# EAGLE schematic Dyno Tiva Shield (EAGLE 7.5.0)

## Sheet 1 of 2
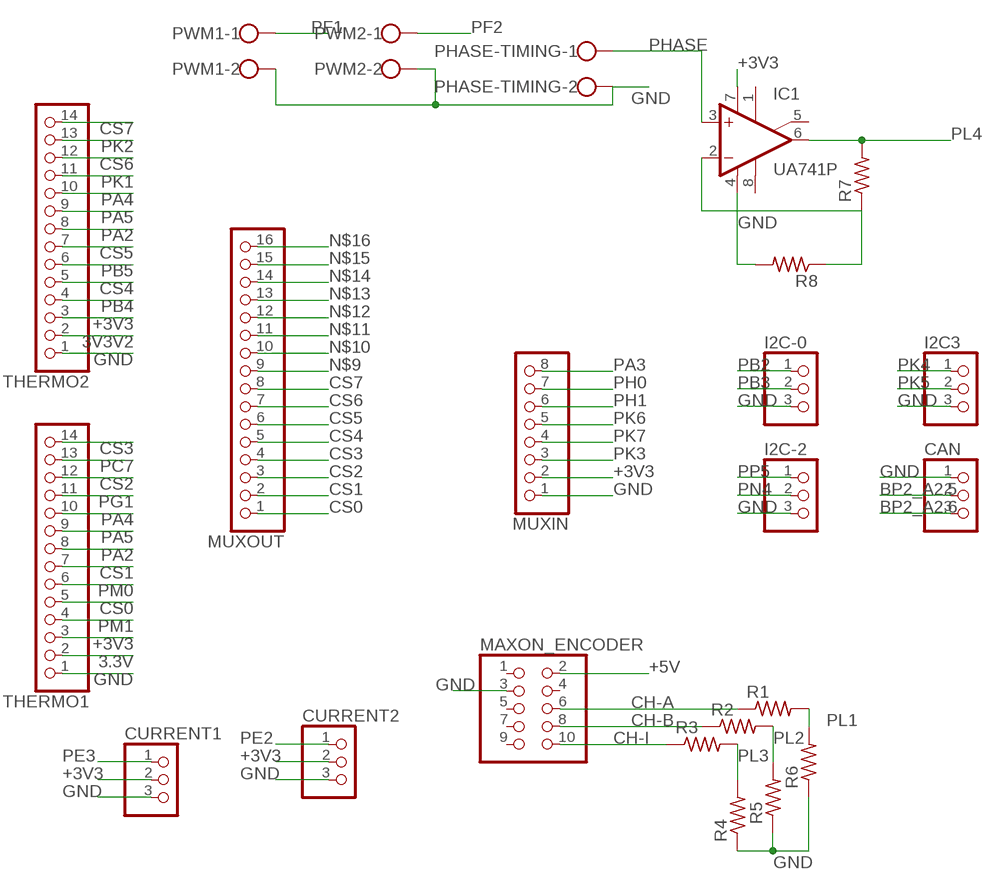
[diagram p0: schematic, sheet 1]

### Parts
CAN  PINHD-1X3  [1X03]
CURRENT1  PINHD-1X3  [1X03]
CURRENT2  PINHD-1X3  [1X03]
I2C3  PINHD-1X3  [1X03]
I2C-0  PINHD-1X3  [1X03]
I2C-2  PINHD-1X3  [1X03]
IC1  UA741P  [DIL08]
MAXON_ENCODER  PINHD-2X5  [2X05]
MUXIN  PINHD-1X8  [1X08]
MUXOUT  PINHD-1X16  [1X16]
PHASE-TIMING  W237-102  [W237-102]
PWM1  W237-102  [W237-102]
PWM2  W237-102  [W237-102]
R1  R-US_M0805  [M0805]
R2  R-US_M0805  [M0805]
R3  R-US_M0805  [M0805]
R4  R-US_M0805  [M0805]
R5  R-US_M0805  [M0805]
R6  R-US_M0805  [M0805]
R7  R-US_M0805  [M0805]
R8  R-US_M0805  [M0805]
THERMO1  PINHD-1X14  [1X14]
THERMO2  PINHD-1X14  [1X14]

### Nets
3.3V: THERMO1.2
3V3V2: THERMO2.2
+3V3: CURRENT1.2 CURRENT2.2 IC1.7(V+) MUXIN.2 THERMO1.3 THERMO2.3 ; also sheet 2
+5V: MAXON_ENCODER.2 ; also sheet 2
BP2_A2.5: CAN.2 ; also sheet 2
BP2_A2.6: CAN.3 ; also sheet 2
CH-A: MAXON_ENCODER.6 R1.1
CH-B: MAXON_ENCODER.8 R2.1
CH-I: MAXON_ENCODER.10 R3.1
CS0: MUXOUT.1 THERMO1.5
CS1: MUXOUT.2 THERMO1.7
CS2: MUXOUT.3 THERMO1.12
CS3: MUXOUT.4 THERMO1.14
CS4: MUXOUT.5 THERMO2.5
CS5: MUXOUT.6 THERMO2.7
CS6: MUXOUT.7 THERMO2.12
CS7: MUXOUT.8 THERMO2.14
GND: CAN.1 CURRENT1.3 CURRENT2.3 I2C3.3 I2C-0.3 I2C-2.3 IC1.4(V-) MAXON_ENCODER.3 MUXIN.1 PHASE-TIMING.2 PWM1.2 PWM2.2 R4.1 R5.1 R6.1 R8.2 THERMO1.1 THERMO2.1 ; also sheet 2
N$2: IC1.2(-IN) R7.1 R8.1
N$9: MUXOUT.9
N$10: MUXOUT.10
N$11: MUXOUT.11
N$12: MUXOUT.12
N$13: MUXOUT.13
N$14: MUXOUT.14
N$15: MUXOUT.15
N$16: MUXOUT.16
PA2: THERMO1.8 THERMO2.8 ; also sheet 2
PA3: MUXIN.8 ; also sheet 2
PA4: THERMO1.10 THERMO2.10 ; also sheet 2
PA5: THERMO1.9 THERMO2.9 ; also sheet 2
PB2: I2C-0.1 ; also sheet 2
PB3: I2C-0.2 ; also sheet 2
PB4: THERMO2.4 ; also sheet 2
PB5: THERMO2.6 ; also sheet 2
PC7: THERMO1.13 ; also sheet 2
PE2: CURRENT2.1 ; also sheet 2
PE3: CURRENT1.1 ; also sheet 2
PF1: PWM1.1 ; also sheet 2
PF2: PWM2.1 ; also sheet 2
PG1: THERMO1.11 ; also sheet 2
PH0: MUXIN.7 ; also sheet 2
PH1: MUXIN.6 ; also sheet 2
PHASE: IC1.3(+IN) PHASE-TIMING.1
PK1: THERMO2.11 ; also sheet 2
PK2: THERMO2.13 ; also sheet 2
PK3: MUXIN.3 ; also sheet 2
PK4: I2C3.1 ; also sheet 2
PK5: I2C3.2 ; also sheet 2
PK6: MUXIN.5 ; also sheet 2
PK7: MUXIN.4 ; also sheet 2
PL1: R1.2 R6.2 ; also sheet 2
PL2: R2.2 R5.2 ; also sheet 2
PL3: R3.2 R4.2 ; also sheet 2
PL4: IC1.6(OUT) R7.2 ; also sheet 2
PM0: THERMO1.6 ; also sheet 2
PM1: THERMO1.4 ; also sheet 2
PN4: I2C-2.2 ; also sheet 2
PP5: I2C-2.1 ; also sheet 2
Unconnected: IC1.1(ON1) IC1.5(ON2) IC1.8(OPT) MAXON_ENCODER.1 MAXON_ENCODER.4 MAXON_ENCODER.5 MAXON_ENCODER.7 MAXON_ENCODER.9

## Sheet 2 of 2
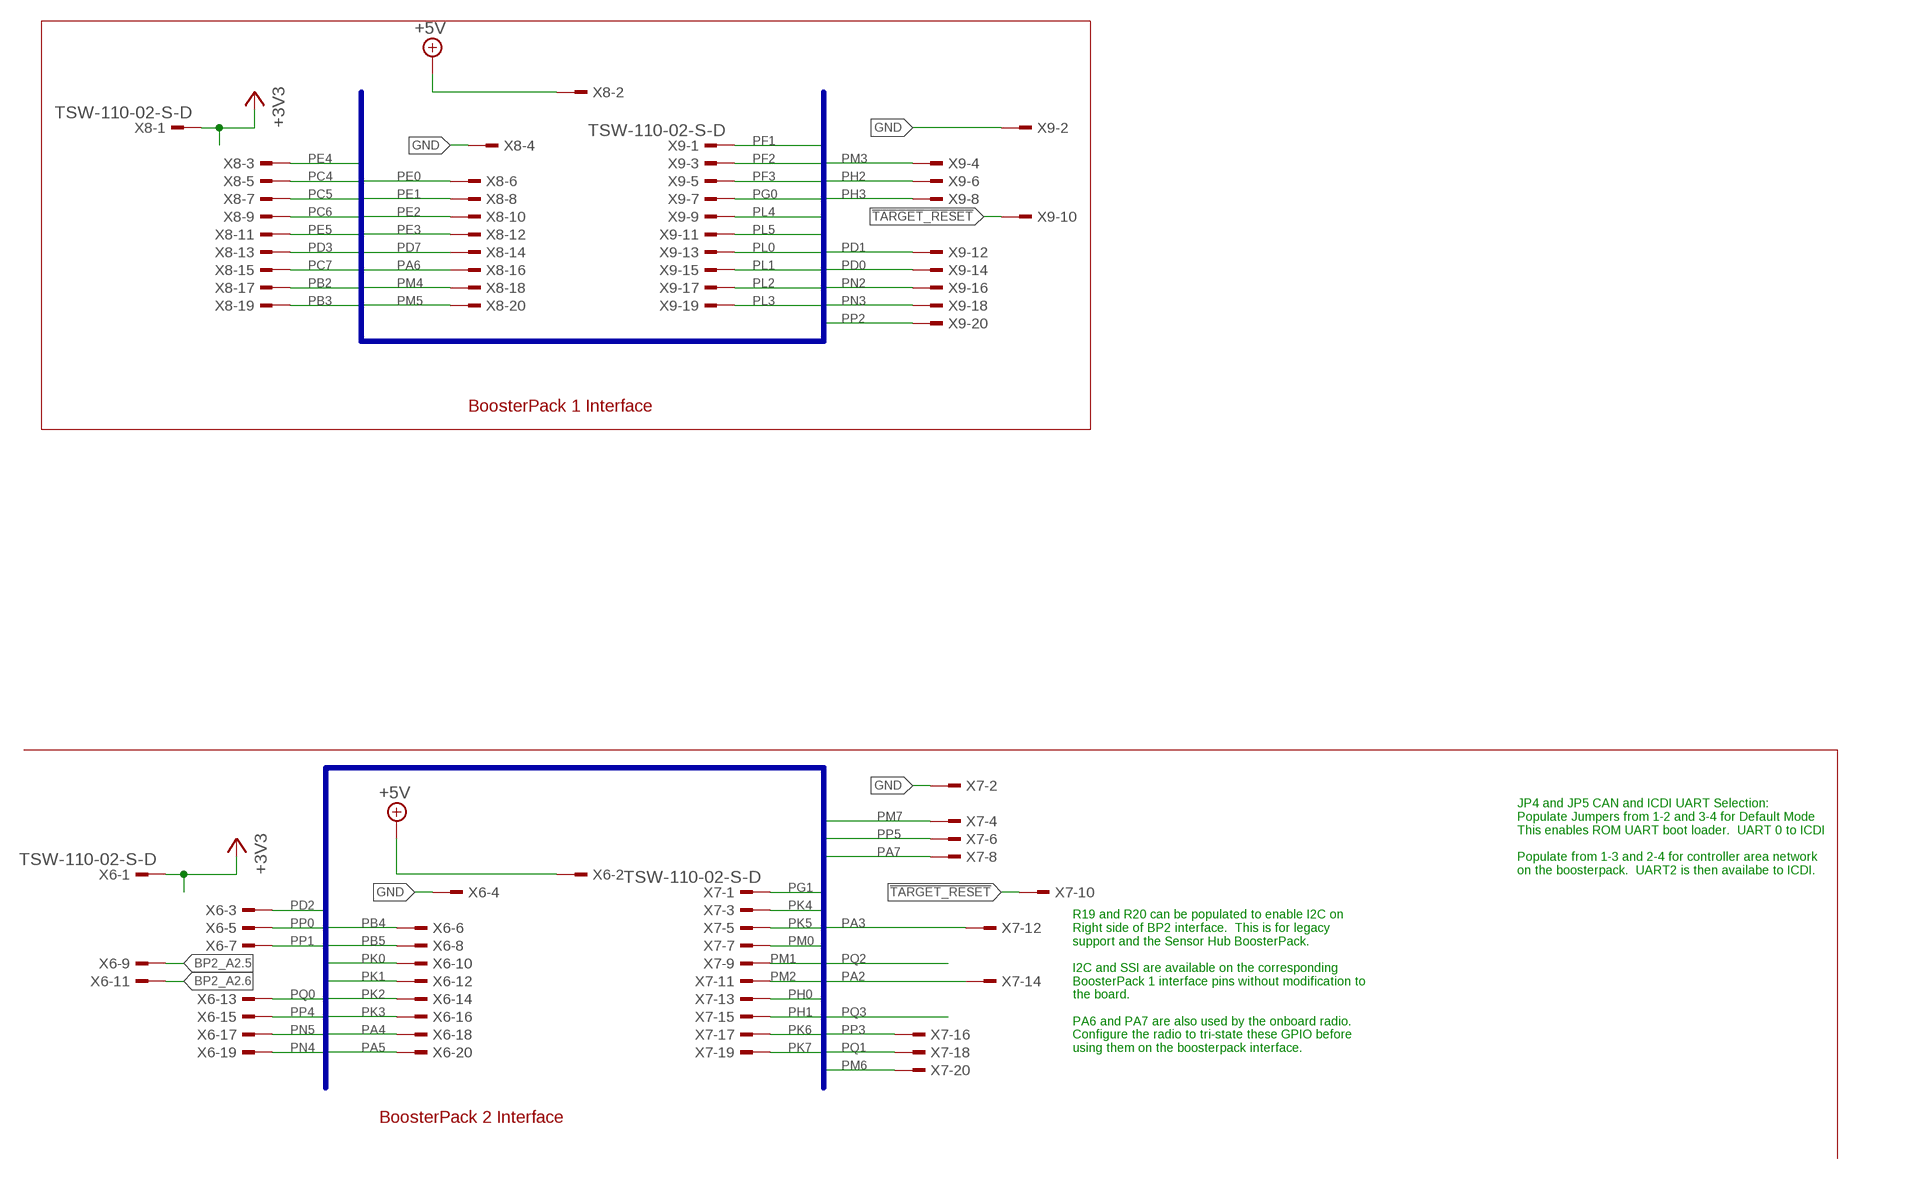
[diagram p1: schematic, sheet 2]

### Parts
X6  TSW-110-02-S-D  [TSW-110-02-S-D]
X7  TSW-110-02-S-D  [TSW-110-02-S-D]
X8  TSW-110-02-S-D  [TSW-110-02-S-D]
X9  TSW-110-02-S-D  [TSW-110-02-S-D]

### Nets
!TARGET_RESET: X7.10 X9.10
+3V3: X6.1 X8.1 ; also sheet 1
+5V: X6.2 X8.2 ; also sheet 1
BP2_A2.5: X6.9 ; also sheet 1
BP2_A2.6: X6.11 ; also sheet 1
GND: X6.4 X7.2 X8.4 X9.2 ; also sheet 1
PA2: X7.14 ; also sheet 1
PA3: X7.12 ; also sheet 1
PA4: X6.18 ; also sheet 1
PA5: X6.20 ; also sheet 1
PA6: X8.16
PA7: X7.8
PB2: X8.17 ; also sheet 1
PB3: X8.19 ; also sheet 1
PB4: X6.6 ; also sheet 1
PB5: X6.8 ; also sheet 1
PC4: X8.5
PC5: X8.7
PC6: X8.9
PC7: X8.15 ; also sheet 1
PD0: X9.14
PD1: X9.12
PD2: X6.3
PD3: X8.13
PD7: X8.14
PE0: X8.6
PE1: X8.8
PE2: X8.10 ; also sheet 1
PE3: X8.12 ; also sheet 1
PE4: X8.3
PE5: X8.11
PF1: X9.1 ; also sheet 1
PF2: X9.3 ; also sheet 1
PF3: X9.5
PG0: X9.7
PG1: X7.1 ; also sheet 1
PH0: X7.13 ; also sheet 1
PH1: X7.15 ; also sheet 1
PH2: X9.6
PH3: X9.8
PK0: X6.10
PK1: X6.12 ; also sheet 1
PK2: X6.14 ; also sheet 1
PK3: X6.16 ; also sheet 1
PK4: X7.3 ; also sheet 1
PK5: X7.5 ; also sheet 1
PK6: X7.17 ; also sheet 1
PK7: X7.19 ; also sheet 1
PL0: X9.13
PL1: X9.15 ; also sheet 1
PL2: X9.17 ; also sheet 1
PL3: X9.19 ; also sheet 1
PL4: X9.9 ; also sheet 1
PL5: X9.11
PM0: X7.7 ; also sheet 1
PM1: X7.9 ; also sheet 1
PM2: X7.11
PM3: X9.4
PM4: X8.18
PM5: X8.20
PM6: X7.20
PM7: X7.4
PN2: X9.16
PN3: X9.18
PN4: X6.19 ; also sheet 1
PN5: X6.17
PP0: X6.5
PP1: X6.7
PP2: X9.20
PP3: X7.16
PP4: X6.15
PP5: X7.6 ; also sheet 1
PQ0: X6.13
PQ1: X7.18

### Buses
GPIO:PA[0..7],PB[0..5],PC[0..7],PD[0..7],PE[0..5],PF[0..4],PG[0..1],PH[0..3],PJ[0..1],PK[0..7],PL[0..7],PM[0..7],PN[0..5],PP[0..5],PQ[0..4]

### Notes on the sheet
- BoosterPack 1 Interface
- JP4 and JP5 CAN and ICDI UART Selection:
  Populate Jumpers from 1-2 and 3-4 for Default Mode
  This enables ROM UART boot loader.  UART 0 to ICDI
  
  Populate from 1-3 and 2-4 for controller area network
  on the boosterpack.  UART2 is then availabe to ICDI.
- R19 and R20 can be populated to enable I2C on 
  Right side of BP2 interface.  This is for legacy 
  support and the Sensor Hub BoosterPack.
  
  I2C and SSI are available on the corresponding
  BoosterPack 1 interface pins without modification to
  the board.
  
  PA6 and PA7 are also used by the onboard radio. 
  Configure the radio to tri-state these GPIO before 
  using them on the boosterpack interface.
- BoosterPack 2 Interface

## Library data of the parts
CAN CURRENT1 CURRENT2 I2C3 I2C-0 I2C-2 = pinhead:PINHD-1X3: PIN HEADER
IC1 = linear:*741: OP AMP
MAXON_ENCODER = pinhead:PINHD-2X5: PIN HEADER
MUXIN = pinhead:PINHD-1X8: PIN HEADER
MUXOUT = pinhead:PINHD-1X16: PIN HEADER
PHASE-TIMING PWM1 PWM2 = con-wago-500:W237-102: WAGO SCREW CLAMP; MPN: 237-102; OC_FARNELL: unknown; OC_NEWARK: 70K9898
R1-R8 = resistor:R-US_: RESISTOR, American symbol
THERMO1 THERMO2 = pinhead:PINHD-1X14: PIN HEADER
X6-X9 = ek-tm4c129exl:TSW-110-02-S-D: THROUGH-HOLE .025" SQ POST HEADER Source: Samtec TSW.pdf; GNUM: G22-THSTK-2X10-BAC; OC_FARNELL: unknown; OC_NEWARK: unknown